# EAGLE design ESP32-S3 Parallel TFT with Touch 4.3“ V2.0 (EAGLE 6.1)
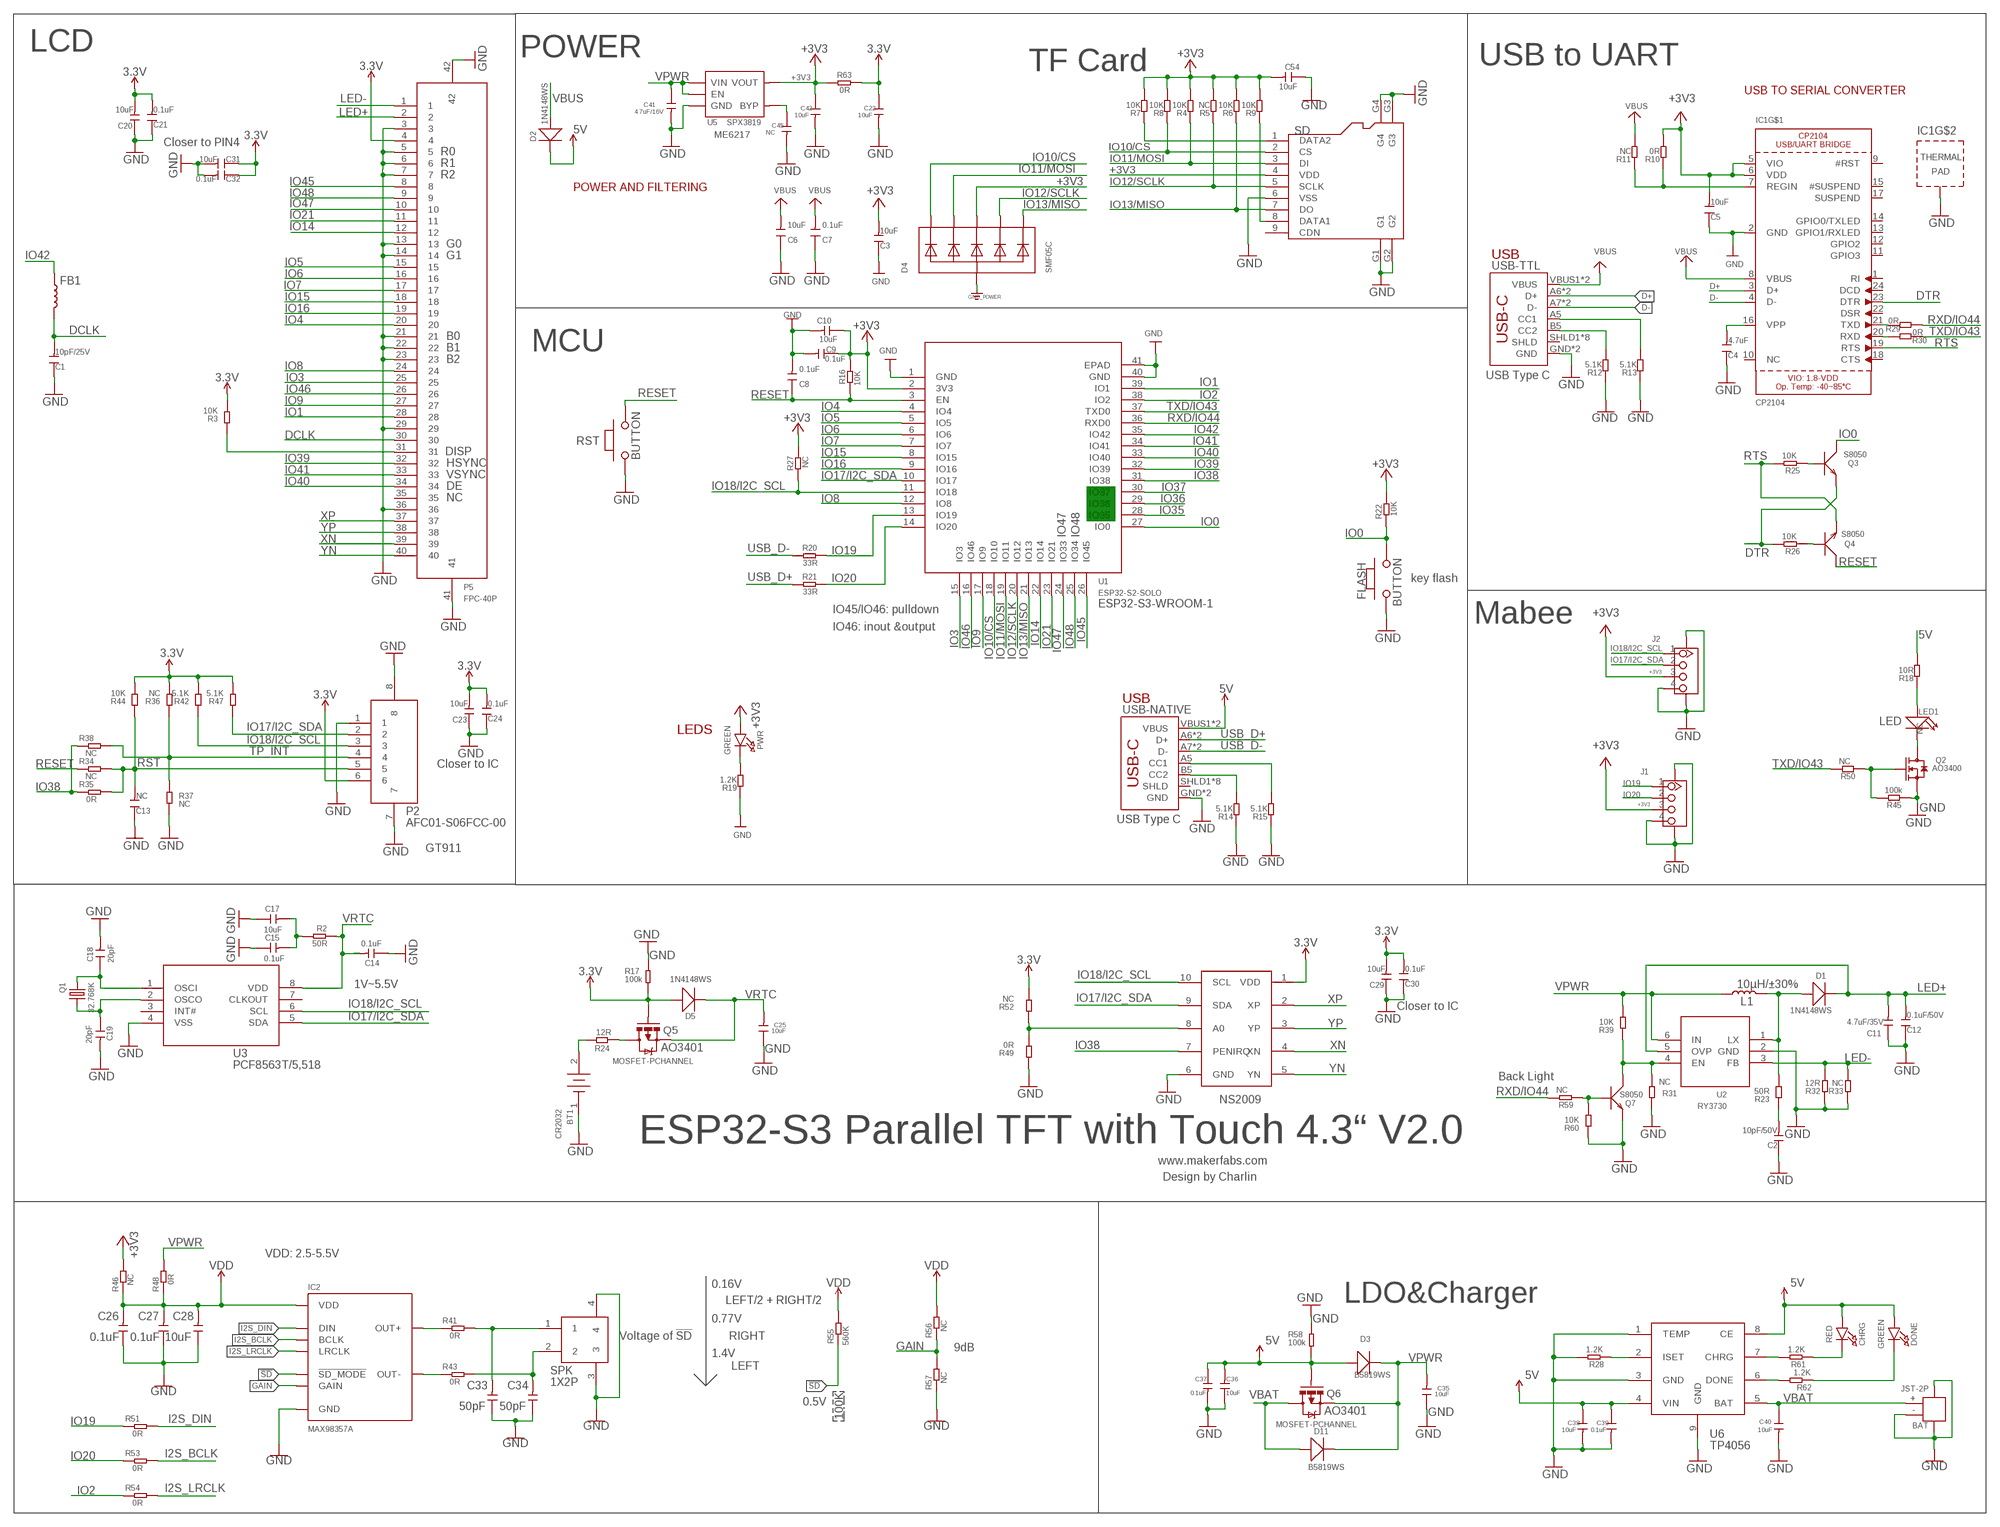
[diagram p0: schematic, sheet 1]

## Parts
BAT  JST-2P  JST-2P-SMD'2.0'  [HW2-SMD-2.0-90D]
BT1  CR2032  [CR2032]
C1  10pF/25V  DISCRETE_C-0603  [DISCRETE_C0603]
C2  10pF/50V  DISCRETE_C-0603  [DISCRETE_C0603]
C3  10uF  DISCRETE_C-0603  [DISCRETE_C0603]
C4  4.7uF  DISCRETE_C-0603  [DISCRETE_C0603]
C5  10uF  DISCRETE_C-0603  [DISCRETE_C0603]
C6  10uF  DISCRETE_C-0603  [DISCRETE_C0603]
C7  0.1uF  DISCRETE_C-0603  [DISCRETE_C0603]
C8  0.1uF  DISCRETE_C-0603  [DISCRETE_C0603]
C9  0.1uF  DISCRETE_C-0603  [DISCRETE_C0603]
C10  10uF  DISCRETE_C-0603  [DISCRETE_C0603]
C11  4.7uF/35V  DISCRETE_C-1206  [DISCRETE_C1206]
C12  0.1uF/50V  DISCRETE_C-0603  [DISCRETE_C0603]
C13  NC  DISCRETE_C-0603  [DISCRETE_C0603]
C14  0.1uF  DISCRETE_C-0603  [DISCRETE_C0603]
C15  0.1uF  DISCRETE_C-0603  [DISCRETE_C0603]
C17  10uF  DISCRETE_C-0603  [DISCRETE_C0603]
C18  20pF  DISCRETE_C-0603  [DISCRETE_C0603]
C19  20pF  DISCRETE_C-0603  [DISCRETE_C0603]
C20  10uF  DISCRETE_C-0603  [DISCRETE_C0603]
C21  0.1uF  DISCRETE_C-0603  [DISCRETE_C0603]
C22  10uF  C-0603  [0603]
C23  10uF  DISCRETE_C-0603  [DISCRETE_C0603]
C24  0.1uF  DISCRETE_C-0603  [DISCRETE_C0603]
C25  10uF  C-0603  [0603]
C26  0.1uF  C-0603  [0603]
C27  0.1uF  C-0603  [0603]
C28  10uF  C-0603  [0603]
C29  10uF  DISCRETE_C-0603  [DISCRETE_C0603]
C30  0.1uF  DISCRETE_C-0603  [DISCRETE_C0603]
C31  10uF  DISCRETE_C-0603  [DISCRETE_C0603]
C32  0.1uF  DISCRETE_C-0603  [DISCRETE_C0603]
C33  50pF  C-0603  [0603]
C34  50pF  C-0603  [0603]
C35  10uF  C-0603  [0603]
C36  10uF  C-0603  [0603]
C37  0.1uF  C-0603  [0603]
C38  10uF  C-0603  [0603]
C39  0.1uF  C-0603  [0603]
C40  10uF  C-0603  [0603]
C41  4.7uF/16V  C-0603  [0603]
C42  10uF  C-0603  [0603]
C45  NC  C-0603  [0603]
C54  10uF  DISCRETE_C-0603  [DISCRETE_C0603]
CHRG  RED  LED0805_NOOUTLINE  [CHIPLED_0805_NOOUTLINE]
D1  1N4148WS  D'0805'  [SOD323]
D2  1N4148WS  D'0805'  [SOD323]
D3  B5819WS  D'0805'  [SOD323]
D4  SMF05C  TVSARRAY_5LANE  [SOT363]
D5  1N4148WS  D'0805'  [SOD323]
D11  B5819WS  D'0805'  [SOD323]
DONE  GREEN  LED0805_NOOUTLINE  [CHIPLED_0805_NOOUTLINE]
FB1  INDUCTORFB-30OHM  [0603]
FLASH  BUTTON  PB157  [157SW]
IC1  CP2104  [QFN24_4MM_SMSC]
IC2  MAX98357A  [TQFN-16]
J1  GROVE-CONNECTOR-SMD'90D'  [HW4-SMD-2.0-90D]
J2  GROVE-CONNECTOR-SMD'90D'  [HW4-SMD-2.0-90D]
L1  10µH/±30%  INDUCTOR-CR54-3.3UH  [CR54]
LED1  NC  DISCRETE_LED3528  [DISCRETE_LED-3528]
P2  AFC01-S06FCC-00  [SMD8-50P-740L535W]
P5  FPC-40P  [SMD42-50P-2560L490W]
PWR  GREEN  LED0805_NOOUTLINE  [CHIPLED_0805_NOOUTLINE]
Q1  32.768K  CRYSTAL_3215  [XTAL3215]
Q2  AO3400  MOSFET-N'SOT23'  [SOT23@1]
Q3  S8050  TRANSISTOR-NPN-SOT23  [SOT23]
Q4  S8050  TRANSISTOR-NPN-SOT23  [SOT23]
Q5  MOSFET-PCHANNEL  [SOT23-3]
Q6  MOSFET-PCHANNEL  [SOT23-3]
Q7  S8050  TRANSISTOR-NPN-SOT23  [SOT23]
R2  50R  R-0603  [R0603]
R3  10K  DISCRETE_R-0603  [DISCRETE_R0603]
R4  10K  DISCRETE_R-0603  [DISCRETE_R0603]
R5  NC  DISCRETE_R-0603  [DISCRETE_R0603]
R6  10K  DISCRETE_R-0603  [DISCRETE_R0603]
R7  10K  DISCRETE_R-0603  [DISCRETE_R0603]
R8  10K  DISCRETE_R-0603  [DISCRETE_R0603]
R9  10K  DISCRETE_R-0603  [DISCRETE_R0603]
R10  0R  DISCRETE_R-0603  [DISCRETE_R0603]
R11  NC  DISCRETE_R-0603  [DISCRETE_R0603]
R12  5.1K  DISCRETE_R-0603  [DISCRETE_R0603]
R13  5.1K  DISCRETE_R-0603  [DISCRETE_R0603]
R14  5.1K  DISCRETE_R-0603  [DISCRETE_R0603]
R15  5.1K  DISCRETE_R-0603  [DISCRETE_R0603]
R16  10K  R-0603  [R0603]
R17  100k  R-0603  [R0603]
R18  10R  DISCRETE_R-0603  [DISCRETE_R0603]
R19  1.2K  DISCRETE_R-0603  [DISCRETE_R0603]
R20  33R  R-0603  [R0603]
R21  33R  R-0603  [R0603]
R22  10K  R-0603  [R0603]
R23  50R  DISCRETE_R-0603  [DISCRETE_R0603]
R24  12R  R-0603  [R0603]
R25  10K  R-0603  [R0603]
R26  10K  R-0603  [R0603]
R27  NC  R-0603  [R0603]
R28  1.2K  R-0603  [R0603]
R29  0R  R-0603  [R0603]
R30  0R  R-0603  [R0603]
R31  NC  DISCRETE_R-0603  [DISCRETE_R0603]
R32  12R  DISCRETE_R-0603  [DISCRETE_R0603]
R33  NC  DISCRETE_R-0603  [DISCRETE_R0603]
R34  NC  R-0603  [R0603]
R35  0R  R-0603  [R0603]
R36  NC  DISCRETE_R-0603  [DISCRETE_R0603]
R37  NC  DISCRETE_R-0603  [DISCRETE_R0603]
R38  NC  R-0603  [R0603]
R39  10K  DISCRETE_R-0603  [DISCRETE_R0603]
R41  0R  R-0603  [R0603]
R42  5.1K  DISCRETE_R-0603  [DISCRETE_R0603]
R43  0R  R-0603  [R0603]
R44  10K  DISCRETE_R-0603  [DISCRETE_R0603]
R45  100k  R-0603  [R0603]
R46  NC  R-0603  [R0603]
R47  5.1K  DISCRETE_R-0603  [DISCRETE_R0603]
R48  0R  R-0603  [R0603]
R49  0R  DISCRETE_R-0603  [DISCRETE_R0603]
R50  NC  R-0603  [R0603]
R51  0R  R-0603  [R0603]
R52  NC  DISCRETE_R-0603  [DISCRETE_R0603]
R53  0R  R-0603  [R0603]
R54  0R  R-0603  [R0603]
R55  560K  R-0603  [R0603]
R56  NC  R-0603  [R0603]
R57  NC  R-0603  [R0603]
R58  100k  R-0603  [R0603]
R59  NC  DISCRETE_R-0603  [DISCRETE_R0603]
R60  10K  DISCRETE_R-0603  [DISCRETE_R0603]
R61  1.2K  R-0603  [R0603]
R62  1.2K  R-0603  [R0603]
R63  0R  R-0603  [R0603]
RST  BUTTON  PB157  [157SW]
SD  HOLDER-MICROSD-9P  [9P-SMD-W/-RING]
SPK  1X2P  [1X2P-SMT1.25MM]
U1  ESP32­S2­SOLO  [ESP32-­S2-­SOLO]
U2  RY3730  [SOT23-6]
U3  PCF8563T/5,518  [SOP8]
U5  SPX3819  [SOT23-5]
U6  TP4056  [SOP8-1.27P]
U8  NS2009  [MSOP10]
USB-NATIVE  USB_C5  [USB-C-16P-5]
USB-TTL  USB_C5  [USB-C-16P-5]

## Nets
3.3V: C20.2 C21.2 C22.1 C23.2 C24.2 C29.2 C30.2 C31.1 C32.1 D5.+ P2.6 P5.4 Q5.1(G) R3.2 R17.1 R36.2 R42.2 R44.2 R47.2 R52.2 R63.2 U8.1(VDD)
5V: C36.2 C37.1 C38.1 C39.1 CHRG.A D2.- D3.+ DONE.A Q6.1(G) R18.2 R58.1 U6.4(VIN) U6.8(CE) USB-NATIVE.VBUS1(VBUS) USB-NATIVE.VBUS2(VBUS)
!SD: IC2.P$4(!SD_MODE) R55.1
+3V3: C3.2 C5.2 C9.1 C10.1 C42.1 C54.2 D4.4(C3) IC1.5(VIO) IC1.6(VDD) J1.3 J2.3 PWR.A R4.2 R5.2 R6.2 R7.2 R8.2 R9.2 R10.2 R16.2 R22.2 R27.2 R46.2 R63.1 SD.4(VDD) U1.2(3V3) U5.5(VOUT)
D+: IC1.3(D+) USB-TTL.A6(D+) USB-TTL.B6(D+)
D-: IC1.4(D-) USB-TTL.A7(D-) USB-TTL.B7(D-)
DCLK: C1.2 FB1.2 P5.30
DTR: IC1.23(DTR) Q3.2(E) R26.2
GAIN: IC2.P$2(GAIN) R56.1 R57.2
GND: BAT.3 BAT.4 BAT.- BT1.1 C1.1 C2.1 C3.1 C4.1 C5.1 C6.1 C7.1 C8.2 C9.2 C10.2 C11.1 C12.1 C13.1 C14.1 C15.1 C17.1 C18.2 C19.2 C20.1 C21.1 C22.2 C23.1 C24.1 C25.1 C26.1 C27.1 C28.1 C29.1 C30.1 C31.2 C32.2 C33.1 C34.1 C35.1 C36.1 C37.2 C38.2 C39.2 C40.2 C41.2 C42.2 C45.2 C54.1 D4.2(A) FLASH.1 IC1.2(GND) IC1.THERM(TP) IC2.P$3(GND) IC2.P$11(GND) IC2.P$15(GND) IC2.P$EP(GND) J1.4 J1.SS1 J1.SS2 J2.4 J2.SS1 J2.SS2 P2.1 P2.7 P2.8 P5.3 P5.5 P5.6 P5.7 P5.13 P5.14 P5.21 P5.22 P5.23 P5.29 P5.36 P5.41 P5.42 Q2.2(S) Q7.2(E) R12.1 R13.1 R14.1 R15.1 R17.2 R19.1 R28.2 R31.1 R32.1 R33.1 R37.2 R45.1 R49.1 R57.1 R58.2 R60.1 RST.1 SD.6(VSS) SD.G1 SD.G2 SD.G3 SD.G4 SPK.3 SPK.4 U1.1(GND) U1.40(GND) U1.41(EPAD) U2.2(GND) U3.4(VSS) U5.2(GND) U6.1(TEMP) U6.3(GND) U6.9(GND) U8.6(GND) USB-NATIVE.GND USB-NATIVE.GND2(GND) USB-TTL.GND USB-TTL.GND2(GND) ; supply symbol labelled GND_POWER
I2S_BCLK: IC2.P$16(BCLK) R53.2
I2S_DIN: IC2.P$1(DIN) R51.2
I2S_LRCLK: IC2.P$14(LRCLK) R54.2
IO0: FLASH.2 Q3.3(C) R22.1 U1.27(IO0)
IO1: P5.28 U1.39(IO1)
IO2: R54.1 U1.38(IO2)
IO3: P5.25 U1.15(IO3)
IO4: P5.20 U1.4(IO4)
IO5: P5.15 U1.5(IO5)
IO6: P5.16 U1.6(IO6)
IO7: P5.17 U1.7(IO7)
IO8: P5.24 U1.12(IO8)
IO9: P5.27 U1.17(IO9)
IO10/CS: D4.1(C1) R8.1 SD.2(CS) U1.18(IO10)
IO11/MOSI: D4.3(C2) R4.1 SD.3(DI) U1.19(IO11)
IO12/SCLK: D4.5(C4) R5.1 SD.5(SCLK) U1.20(IO12)
IO13/MISO: D4.6(C5) R6.1 SD.7(DO) U1.21(IO13)
IO14: P5.12 U1.22(IO14)
IO15: P5.18 U1.8(IO15)
IO16: P5.19 U1.9(IO16)
IO17/I2C_SDA: J2.2 P2.2 R47.1 U1.10(IO17) U3.5(SDA) U8.9(SDA)
IO18/I2C_SCL: J2.1 P2.3 R27.1 R42.1 U1.11(IO18) U3.6(SCL) U8.10(SCL)
IO19: J1.1 R20.2 R51.1 U1.13(IO19)
IO20: J1.2 R21.2 R53.1 U1.14(IO20)
IO21: P5.11 U1.23(IO21)
IO35: U1.28(IO35)
IO36: U1.29(IO36)
IO37: U1.30(IO37)
IO38: R35.1 R38.1 U1.31(IO38) U8.7(PENIRQ)
IO39: P5.32 U1.32(IO39)
IO40: P5.34 U1.33(IO40)
IO41: P5.33 U1.34(IO41)
IO42: FB1.1 U1.35(IO42)
IO45: P5.8 U1.26(IO45)
IO46: P5.26 U1.16(IO46)
IO47: P5.10 U1.24(IO33)
IO48: P5.9 U1.25(IO34)
LED+: C11.2 C12.2 D1.- P5.2 U2.5(OVP)
LED-: P5.1 R32.2 R33.2 U2.3(FB)
N$1: C4.2 IC1.16(VPP)
N$2: Q4.1(B) R26.1
N$3: Q3.1(B) R25.1
N$4: C18.1 Q1.P$1 U3.1(OSCI)
N$5: Q2.1(G) R45.2 R50.1
N$6: R15.2 USB-NATIVE.A5(CC1)
N$7: PWR.C R19.2
N$8: LED1.1(+) R18.1
N$9: LED1.2(-) Q2.3(D)
N$10: R13.2 USB-TTL.A5(CC1)
N$11: R12.2 USB-TTL.B5(CC2)
N$12: IC1.7(REGIN) R10.1 R11.1
N$13: C19.1 Q1.P$2 U3.2(OSCO)
N$14: R14.2 USB-NATIVE.B5(CC2)
N$15: Q5.3(D) R24.1
N$16: C15.2 C17.2 R2.1
N$17: D1.+ L1.P$2 R23.2 U2.1(LX)
N$18: IC1.21(TXD) R29.2
N$19: IC1.20(RXD) R30.2
N$20: BT1.2 R24.2
N$21: IC2.P$9(OUT+) R41.1
N$22: C2.2 R23.1
N$23: IC2.P$10(OUT-) R43.1
N$24: Q7.3(C) R31.2 R39.1 U2.4(EN)
N$25: R49.2 R52.1 U8.8(A0)
N$26: C33.2 R41.2 SPK.1
N$27: C34.2 R43.2 SPK.2
N$28: P5.31 R3.1
N$29: Q7.1(B) R59.1 R60.2
N$30: R28.1 U6.2(ISET)
N$31: R61.2 U6.7(CHRG)
N$32: R62.2 U6.6(DONE)
N$33: CHRG.C R61.1
N$34: DONE.C R62.1
N$47: R7.1 SD.1(DATA2)
N$48: R9.1 SD.8(DATA1)
N$76: C45.1 U5.4(BYP)
RESET: C8.1 Q4.3(C) R16.1 R34.1 RST.2 U1.3(EN)
RST: C13.2 P2.5 R34.2 R35.2 R44.1
RTS: IC1.19(RTS) Q4.2(E) R25.2
RXD/IO44: R29.1 R59.2 U1.36(RXD0)
TP_INT: P2.4 R36.1 R37.1 R38.2
TXD/IO43: R30.1 R50.2 U1.37(TXD0)
USB_D+: R21.1 USB-NATIVE.A6(D+) USB-NATIVE.B6(D+)
USB_D-: R20.1 USB-NATIVE.A7(D-) USB-NATIVE.B7(D-)
VBAT: BAT.+ C40.1 D11.+ Q6.3(D) U6.5(BAT)
VBUS: C6.2 C7.2 D2.+ IC1.8(VBUS) R11.2 USB-TTL.VBUS1(VBUS) USB-TTL.VBUS2(VBUS)
VDD: C26.2 C27.2 C28.2 IC2.P$7(VDD) IC2.P$8(VDD) R46.1 R48.1 R55.2 R56.2
VPWR: C35.2 C41.1 D3.- D11.- L1.P$1 Q6.2(S) R39.2 R48.2 U2.6(IN) U5.1(VIN) U5.3(EN)
VRTC: C14.2 C25.2 D5.- Q5.2(S) R2.2 U3.8(VDD)
XN: P5.39 U8.4(XN)
XP: P5.37 U8.2(XP)
YN: P5.40 U8.5(YN)
YP: P5.38 U8.3(YP)
Unconnected: IC1.1(RI) IC1.9(#RST) IC1.10(NC) IC1.11(GPIO3) IC1.12(GPIO2) IC1.13(GPIO1/RXLED) IC1.14(GPIO0/TXLED) IC1.15(#SUSPEND) IC1.17(SUSPEND) IC1.18(CTS) IC1.22(DSR) IC1.24(DCD) P5.35 SD.9(CDN) U3.3(INT#) U3.7(CLKOUT) USB-NATIVE.SHLD1(SHLD) USB-NATIVE.SHLD2(SHLD) USB-NATIVE.SHLD3(SHLD) USB-NATIVE.SHLD4(SHLD) USB-NATIVE.SHLD5(SHLD) USB-NATIVE.SHLD6(SHLD) USB-NATIVE.SHLD7(SHLD) USB-NATIVE.SHLD8(SHLD) USB-TTL.SHLD1(SHLD) USB-TTL.SHLD2(SHLD) USB-TTL.SHLD3(SHLD) USB-TTL.SHLD4(SHLD) USB-TTL.SHLD5(SHLD) USB-TTL.SHLD6(SHLD) USB-TTL.SHLD7(SHLD) USB-TTL.SHLD8(SHLD)

## Notes on the sheet
- LCD | POWER
- TF Card | USB to UART
- USB TO SERIAL CONVERTER
- ME6217
- Closer to PIN4
- R0
- R1
- R2
- POWER AND FILTERING
- G0
- G1 | USB
- B0
- B1 | MCU
- B2
- USB Type C
- DISP
- HSYNC
- VSYNC
- DE
- NC
- IO47 | IO48
- key flash
- ESP32-S3-WROOM-1
- IO45/IO46: pulldown
- Mabee
- IO46: inout &output
- USB
- LED
- LEDS
- Closer to IC
- USB Type C
- GT911
- 1V~5.5V
- Closer to IC
- AO3401
- Back Light
- NS2009
- ESP32-S3 Parallel TFT with Touch 4.3“ V2.0
- www.makerfabs.com
- Design by Charlin
- VDD: 2.5-5.5V
- 0.16V
- LEFT/2 + RIGHT/2 | LDO&Charger
- 0.77V
- Voltage of !SD | RIGHT
- 9dB
- 1.4V
- LEFT
- 0.5V
- AO3401
- 100K

## Library data of the parts
BAT = Connector-new:JST-2P-SMD: 2P-SMD-1.0-90D:320110054;2P-SMD-2.0-90D:320110026
BT1 = sale:CR2032
C1-C15 C17-C21 C23 C24 C29-C32 C54 = A9G:DISCRETE_C*: Ceramic Capacitors
C22 C25-C28 C33-C42 C45 = Discrete:C*: Ceramic Capacitors
CHRG DONE PWR = microbuilder:LED: LED 0603 - 0603 Surface Mount Package 2mA: Green LED - Low Power (3.9mcd, 2ma, 1.7Vf) - Digikey: 475-2709-2-ND Orange LED - Low Power (9.8mcd, 2ma, 1.8Vf) - Digikey: 475-1194-2-ND Red LED - Low Power (5mcd, 2ma, 1.8Vf) - Digikey: 475-1195-2-ND Yellow LED - Low Power (7mcd, 2ma, 1.8Vf) - Digikey: 475-1196-2-ND 5mA: Blue LED - Low Power (17mcd, 5ma, 2.9Vf) - Digikey: LNJ937W8CRACT-ND 0805 - 0805 Surface Mount Package 2mA: Red LED (8.8mcd, 2mA, 1.8Vf, Clear) - Low Power [Digikey: 475-2510-1-ND] Green LED (5mcd, 2mA, 1.8Vf, Clear) - Low Power [Digikey: 475-2730-1-ND] Yellow LED (11.3mcd, 2mA, 1.8Vf, Clear) - Low Power [Digikey: 475-2555-1-ND] 20mA: Red LED (104mcd, 20mA, Diffused) - LS R976 [Digikey: 475-1278-6-ND] Red LED (12mcd, 20mA, 2.0Vf, Clear) - APT2012EC [Digikey: 754-1128-1-ND] Green LED (15mcd, 20mA, 2.2Vf, Clear) - APT2012GC [Digikey: 754-1131-1-ND] Orange LED (160mcd, 20mA, 2.1Vf, Clear) - APT2012SECK [Digikey: 754-1130-1-ND] 1206 - 1206 Surface Mount Package Green LED (26mcd, 20mA, Diffused) - LG N971 [Digikey: 475-1407-6-ND] Red LED (15mcd, 20mA, Diffused) - LH N974 [Digikey: 475-1416-6-ND] Cree - Cree High-Power Surface Mount LEDs XPEBWT-L1-0000-00D50 - White 111lm 350mA 2.9Vf 6200K 110° XTEAWT-00-0000-00000LEE3 - White 114lm 350mA 2.85Vf 5000K 115° Everlight - Everlight 45-21 Series Surface Mount LEDs 45-21/QK2C-B2832AC2CB2/2T - Warm White 2000mcd 20mA 3.25Vf 3050K 120° 45-21/LK2C-B38452C4CB2/2T - Nuetral White 2000mcd 20mA 3.25Vf 4150K 120° 45-21/LK2C-B50634C6CB2/2T - Cold White 2200mcd 20mA 3.25Vf 5650K 120° PLCC2 Reverse Mount LS T77K-J1L2-1-0-2-R18-Z - Red 11.25mcd 2mA 1.8Vf 630nm 120° LO T77K-L1M2-24-Z - Orange 19.6mcd 2mA 1.8Vf 606nm 120° LY T77K-K2M1-26-Z - Yellow 15.7mcd 2mA 1.8Vf 587nm 120°
D1-D3 D5 D11 = Discrete:D*
D4 = microbuilder:TVSARRAY_5LANE: Voltage Transient Suppressor Array SOT363 SMF05C - 100W 5V: Digikey - SMF05CT1GOSCT-ND
FB1 = SparkFun-Coils:INDUCTOR: Inductors Resist changes in electrical current. Basically a coil of wire. SparkFun Products: SparkFun Load Cell Amplifier - HX711 <https://www.sparkfun.com/products/13879> IOIO-OTG - V2.2 <https://www.sparkfun.com/products/13613>; PROD_ID: NDUC-07859
FLASH RST = MySMD:PB157
IC1 = microbuilder:CP2104: CP2104 - USB to UART Bridge VDD Output: 3.45V
IC2 = SparkFun-IC-Amplifiers:MAX98357A: I2S DAC 3.2W (4-8ohm); PROD_ID: IC-14032
J1 J2 = Connector-new:GROVE-CONNECTOR-SMD: 4P-SMD-2.0:320110030;4P-SMD-2.0-90D:320110032
L1 = SparkFun-Coils:INDUCTOR: Inductors Resist changes in electrical current. Basically a coil of wire. SparkFun Products: SparkFun Load Cell Amplifier - HX711 <https://www.sparkfun.com/products/13879> IOIO-OTG - V2.2 <https://www.sparkfun.com/products/13613>; PROD_ID: NDUC-11157; VALUE: 3.3µH/±30%/3.4A
LED1 = Relay:DISCRETE_LED*
P2 = self:AFC01-S06FCC-00
P5 = self:FPC-40P
Q1 = microbuilder:CRYSTAL: Crystals HC49UP - Surface Mount Crystal 4.0MHz 18pF +/-30ppm Surface Mount Crystal [Digikey: 535-9857-1-ND] 12.0 MHz Surface Mount Crystal [Digikey: 535-9869-6-ND] 25.0 MHz Surface Mount Crystal [Digikey: 535-9078-1-ND] 2.5 x 2.0mm - MEMs SMT Crystal 16.0 MHz 10pF 20ppm 2.5 x 2.0mm Crystal [Digikey -40-85°C: 535-10923-1-ND] 3.2 x 2.5mm - MEMs SMT Crystal 12.0 MHz 8pF 15ppm 3.2 x 2.5mm Crystal [Digikey: -10-70°C: 644-1047-1-ND -40-125°C: 644-1128-1-ND] 40~85°C cheaper: 644-1173-6-ND 16.0 MHz 8pF 15ppm 3.2 x 2.5mm Crystal [Digikey: -10-70°C: 644-1049-1-ND -40-125°C: 644-1129-2-ND]-40~85°C cheaper: 644-1175-6-ND 16.0 MHz 10pF 10ppm 3.2 x 2.5mm Crystal [Digikey: 644-1100-1-ND] 27.12 MHz 18pF 30ppm 3.2 x 2.5mm Crystal [Digikey: 887-1424-1-ND] 27.12MHz 10pF 10ppm 3.2 x 2.5mm Crystal [Digikey: 887-1329-1-ND] 4.9 x 1.8mm - MEMs SMT Crystal 32.768 KHz 12.5pF 20ppm 4.9 x 1.8mm Crystal [Digikey: SE2415CT-ND] 8.0 x 3.8mm - Surface Mount Crystal 32.768kHz 12.5pF 20ppm -40°C-85°C [Digikey: 535-9166-2-ND] Cylinder 32.768KHz Cylinder Crystal (2x6mm body) [Ex. Digikey: 300-8341-2-ND]
Q2 = Discrete:MOSFET-N: IRLL014: http://www.vishay.com/docs/91319/sihll014.pdf
Q3 Q4 Q7 = Discrete:TRANSISTOR-NPN*: NPN audion
Q5 Q6 = User-Submitted:MOSFET-PCHANNEL: Generic PMOSFET IRLML2244 - TRANS-11153 (SOT-23 -20V -4.3A) (1.Gate 2.Source 3.Drain) FQP27P06 - COM-10349 <http://www.sparkfun.com/products/10349> (TO-220 -60V -27A) (1.Gate 2.Source 3.Drain); PROD_ID: TRANS-08285
R2 R16 R17 R20-R22 R24-R30 R34 R35 R38 R41 R43 R45 R46 R48 R50 R51 R53-R58 R61-R63 = Discrete:R*
R3-R15 R18 R19 R23 R31-R33 R36 R37 R39 R42 R44 R47 R49 R52 R59 R60 = A9G:DISCRETE_R*
SD = Connector:HOLDER-MICROSD-9P
SPK = sale:1X2P
U1 = self:ESP32­S2­SOLO
U2 = sale:RY3730
U3 = sale:PCF8563T/5,518
U5 = IC:SPX3819
U6 = self:TP4056
U8 = NS2009:NS2009
USB-NATIVE USB-TTL = USBC:USB_C: USB Type C 16Pin Connector Super Speed pins not available on the 16-pin purely SMD connector so this part is best for USB 2.0 implementations. D1 and D2 are tied together enabling D+/- no matter which way the cable is plugged into the connector. The two channel configuration pins (CC1/2) are exposed. These are normally connected to ground via 5.1k resistors but can be reconfigured for high current/high power applications.

## Net classes
0 default: width 0.152 mm, drill 0.305 mm, clearance 0.152 mm
1 vbat: width 0.254 mm, drill 0.305 mm, clearance 0.152 mm

## Board
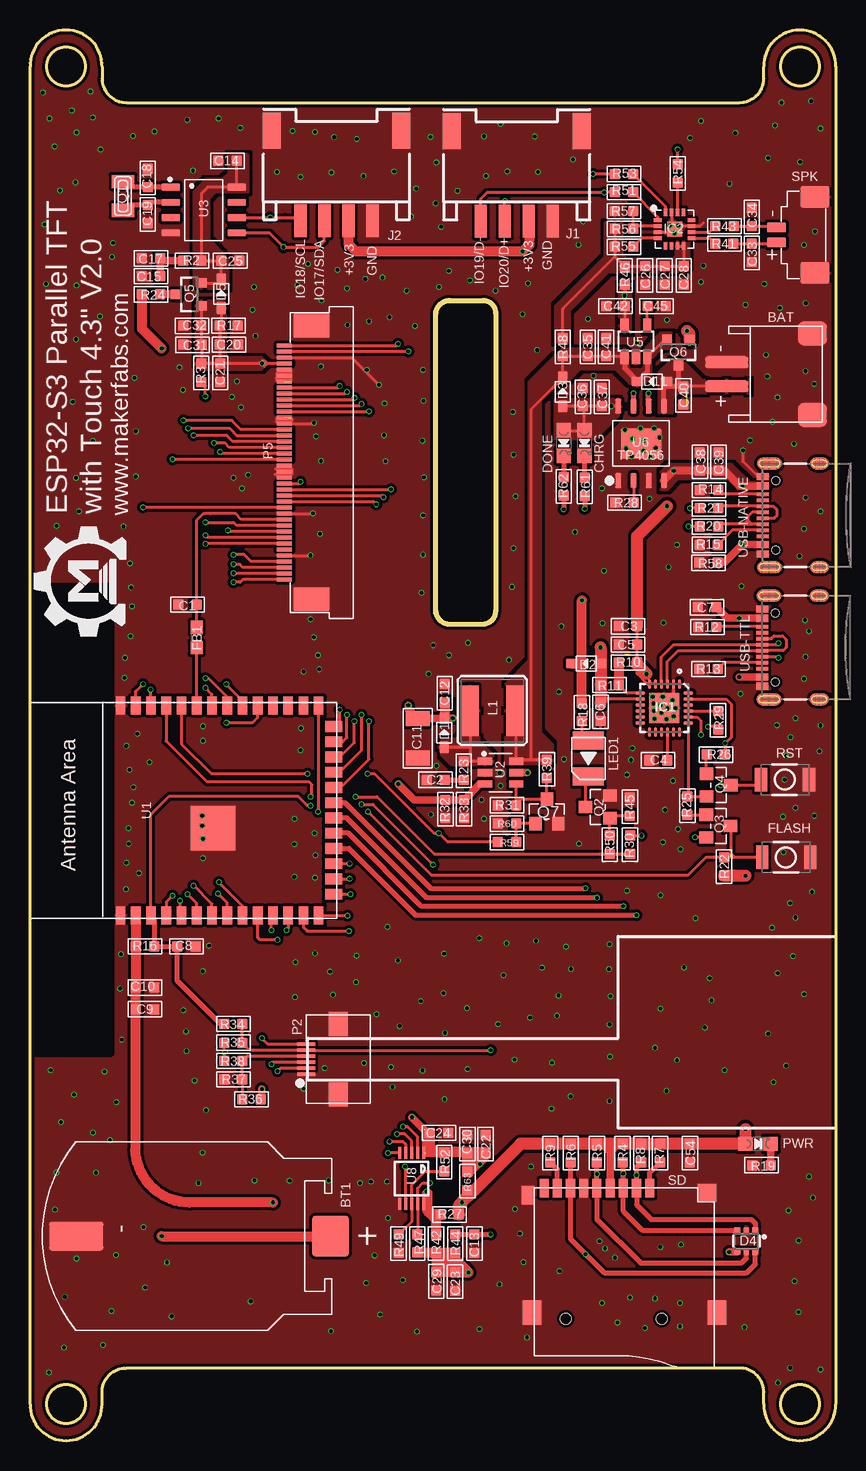
[diagram p1: board, top side]
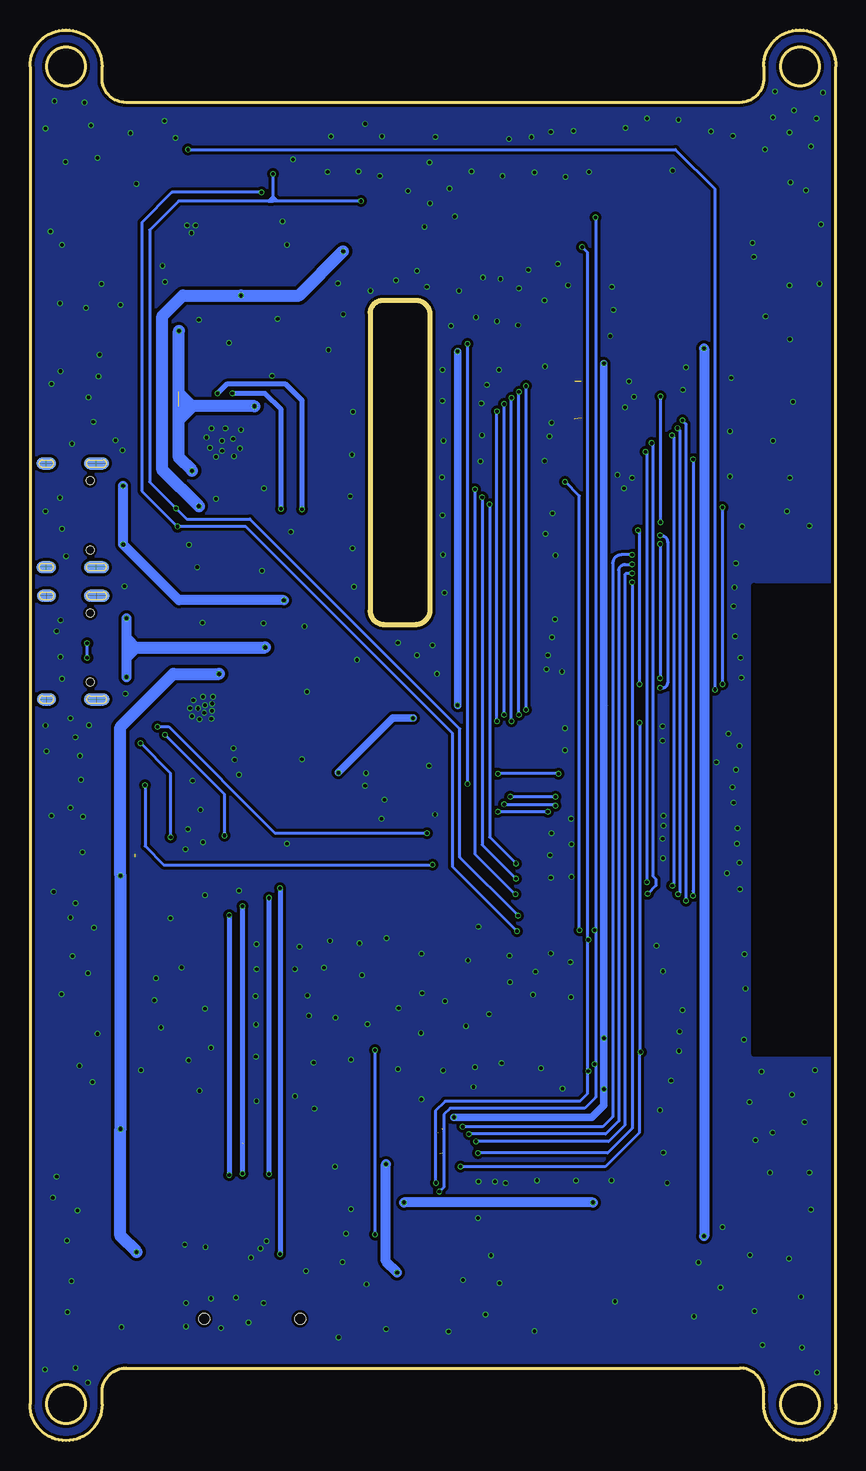
[diagram p2: board, bottom side, seen from below]

Size 67.15 x 117.6 mm. Coordinates in mm from the lower left corner, seen from the top.
Outline: 61.15,3.05 61.15,4.05 arc90 59.15,6.05 8,6.05 arc90 6,4.05 6,3.05 arc-182 0,3.05 0,114.55 arc-182 6,114.55 6,113.55 arc90 8,111.55 59.15,111.55 arc90 61.15,113.55 61.15,114.55 arc-182 67.15,114.55 67.15,3.05 arc-182 61.15,3.05
Outline: 38.81,94.01 38.81,69.18 arc-90 37.67,68.05 35,68.05 arc-90 33.81,69.24 33.81,93.87 arc-90 34.98,95.05 37.77,95.05 arc-90 38.81,94.01
Outline: circle at 3,114.55 radius 1.6
Outline: circle at 3,3.05 radius 1.6
Outline: circle at 64.15,3.05 radius 1.6
Outline: circle at 64.15,114.55 radius 1.6
Copper layers (1*16): Top 0.035mm / dielectric 1.5mm / Bottom 0.035mm
Design rules: minimum track width 6mil, minimum drill 10mil, track to track 6mil, track to pad 6mil, pad to pad 6mil, via to via 6mil, smd to smd 0mil, copper to edge 10mil, drill to drill 10mil, minimum pad ring 3mil, minimum via ring 3mil, stop-mask expansion 2mil, vias tented up to drill 100mil, thermal gap 0mil
tRestrict: area 0,32.2 to 6.8,71.2
bRestrict: area 0,32.2 to 6.8,71.2

### Footprints (pad centres in the part's own frame; a part is rotated, then mirrored left to right if it is on the bottom)
HW2-SMD-2.0-90D = smd 2 x 2.4: 3 3.4,-2.181; 4 -3.4,-2.181 | smd 1 x 3.6: + -1,4.953; - 1,4.953
CR2032 = smd 4.5 x 2.4: 1 -10.95,0 | smd 3.05 x 3.4: 2 10.225,0
DISCRETE_C0603 = smd 0.889 x 0.889: 1 -0.762,0; 2 0.762,0
DISCRETE_C1206 = smd 1.27 x 2.032: 1 -1.651,0; 2 1.651,0
0603 = smd 0.889 x 0.889: 1 -0.762,0; 2 0.762,0
CHIPLED_0805_NOOUTLINE = smd 1.2 x 1.2: A 0,-1.05; C 0,1.05
SOD323 = smd 1 x 0.8: + -1.2,0; - 1.2,0
SOT363 = smd 0.5 x 0.5: 1 -0.75,-0.9; 3 0.75,-0.9; 4 0.75,0.9; 6 -0.75,0.9 | smd 0.4 x 0.5: 2 0,-0.9; 5 0,0.9
0603' = smd 1.1 x 1: 1 -0.85,0; 2 0.85,0
157SW = smd 1.016 x 1.981: 1 0,0; 2 4,0
QFN24_4MM_SMSC = smd 0.8 x 0.28: 1 -2,1.25; 2 -2,0.75; 3 -2,0.25; 4 -2,-0.25; 5 -2,-0.75; 6 -2,-1.25; 13 2,-1.25; 14 2,-0.75; 15 2,-0.25; 16 2,0.25; 17 2,0.75; 18 2,1.25 | smd 0.28 x 0.8: 7 -1.25,-2; 8 -0.75,-2; 9 -0.25,-2; 10 0.25,-2; 11 0.75,-2; 12 1.25,-2; 19 1.25,2; 20 0.75,2; 21 0.25,2; 22 -0.25,2; 23 -0.75,2; 24 -1.25,2 | smd 2.5 x 2.5: THERM 0,0
TQFN-16 = smd 0.3 x 0.65: P$1 -0.75,-1.4; P$2 -0.25,-1.4; P$3 0.25,-1.4; P$4 0.75,-1.4; P$9 0.75,1.4; P$10 0.25,1.4; P$11 -0.25,1.4; P$12 -0.75,1.4 | smd 0.65 x 0.3: P$5 1.4,-0.75; P$6 1.4,-0.25; P$7 1.4,0.25; P$8 1.4,0.75; P$13 -1.4,0.75; P$14 -1.4,0.25; P$15 -1.4,-0.25; P$16 -1.4,-0.75 | smd 1.23 x 1.23: P$EP 0,0
HW4-SMD-2.0-90D = smd 1.01 x 2.74: 1 -3,-0.1; 2 -1,-0.1; 3 1,-0.1; 4 3,-0.1 | smd 1.5 x 3: SS1 -5.4,7.4; SS2 5.4,7.4
CR54 = smd 4.2 x 1.4: P$1 0,1.85; P$2 0,-1.85
DISCRETE_LED-3528 = smd 1.5 x 2.6: 1 -1.5,0; 2 1.5,0
SMD8-50P-740L535W = smd 0.3 x 1.5: 1 -1.25,0; 2 -0.75,0; 3 -0.25,0; 4 0.25,0; 5 0.75,0; 6 1.25,0 | smd 2 x 1.6: 7 2.95,-2.68; 8 -2.95,-2.68
SMD42-50P-2560L490W = smd 0.3 x 1.3: 1 9.75,0; 2 9.25,0; 3 8.75,0; 4 8.25,0; 5 7.75,0; 6 7.25,0; 7 6.75,0; 8 6.25,0; 9 5.75,0; 10 5.25,0; 11 4.75,0; 12 4.25,0; 13 3.75,0; 14 3.25,0; 15 2.75,0; 16 2.25,0; 17 1.75,0; 18 1.25,0; 19 0.75,0; 20 0.25,0; 21 -0.25,0; 22 -0.75,0; 23 -1.25,0; 24 -1.75,0; 25 -2.25,0; 26 -2.75,0; 27 -3.25,0; 28 -3.75,0; 29 -4.25,0; 30 -4.75,0; 31 -5.25,0; 32 -5.75,0; 33 -6.25,0; 34 -6.75,0; 35 -7.25,0; 36 -7.75,0; 37 -8.25,0; 38 -8.75,0; 39 -9.25,0; 40 -9.75,0 | smd 2 x 3: 41 -11.4,-2.25; 42 11.4,-2.25
XTAL3215 = smd 1.1 x 1.9: P$1 1.2,0; P$2 -1.2,0
SOT23@1 = smd 1.016 x 1.143: 1 -0.95,-1.016; 2 0.95,-1.016; 3 0,1.016
SOT23 = smd 1.016 x 1.143: 1 -0.95,-1.016; 2 0.95,-1.016; 3 0,1.016
SOT23-3 = smd 0.8 x 0.9: 1 -0.95,-1; 2 0.95,-1; 3 0,1.1
R0603 = smd 0.889 x 0.889: 1 -0.762,0; 2 0.762,0
DISCRETE_R0603 = smd 0.889 x 0.889: 1 -0.762,0; 2 0.762,0
9P-SMD-W/-RING = smd 1.524 x 0.762: 1 0,4.4; 2 0,3.3; 3 0,2.2; 4 0,1.1; 5 0,0; 6 0,-1.1; 7 0,-2.2; 8 0,-3.3; 9 0,-4.4 | smd 1.524 x 1.016: G1 0.6,-5.746 | smd 2.032 x 1.524: G2 10.373,-5.4; G3 10.373,10 | smd 1.524 x 1.524: G4 0.392,9.181 | hole 0.889: 10.9,-2.6; 10.9,5.4
1X2P-SMT1.25MM = smd 0.8 x 1.6: 1 -0.625,0; 2 0.625,0 | smd 1.8 x 2.4: 3 3.175,-3.2; 4 -3.175,-3.2
ESP32-­S2-­SOLO = smd 1.5 x 0.9: 1 -8.75,5.26; 2 -8.75,3.99; 3 -8.75,2.72; 4 -8.75,1.45; 5 -8.75,0.18; 6 -8.75,-1.09; 7 -8.75,-2.36; 8 -8.75,-3.63; 9 -8.75,-4.9; 10 -8.75,-6.17; 11 -8.75,-7.44; 12 -8.75,-8.71; 13 -8.75,-9.98; 14 -8.75,-11.25; 27 8.75,-11.25; 28 8.75,-9.98; 29 8.75,-8.71; 30 8.75,-7.44; 31 8.75,-6.17; 32 8.75,-4.9; 33 8.75,-3.63; 34 8.75,-2.36; 35 8.75,-1.09; 36 8.75,0.18; 37 8.75,1.45; 38 8.75,2.72; 39 8.75,3.99; 40 8.75,5.26 | smd 0.9 x 1.5: 15 -6.985,-12.5; 16 -5.715,-12.5; 17 -4.445,-12.5; 18 -3.175,-12.5; 19 -1.905,-12.5; 20 -0.635,-12.5; 21 0.635,-12.5; 22 1.905,-12.5; 23 3.175,-12.5; 24 4.445,-12.5; 25 5.715,-12.5; 26 6.985,-12.5 | smd 3.7 x 3.7: 41 -1.5,-2.46
SOT23-6 = smd 1.2 x 0.6: 1 -1.3,0.95; 2 -1.3,0; 3 -1.3,-0.95; 4 1.3,-0.95; 5 1.3,0; 6 1.3,0.95
SOP8 = smd 1.52 x 0.6: 1 -2.74,1.905; 2 -2.74,0.635; 3 -2.74,-0.635; 4 -2.74,-1.905; 5 2.74,-1.905; 6 2.74,-0.635; 7 2.74,0.635; 8 2.74,1.905
SOT23-5 = smd 0.69 x 1.2: 1 -0.95,-1.3; 2 0,-1.3; 3 0.95,-1.3; 4 0.95,1.3; 5 -0.95,1.3
SOP8-1.27P = smd 1.27 x 0.51: 1 -3.1,1.905; 2 -3.1,0.635; 3 -3.1,-0.635; 4 -3.1,-1.905; 5 3.1,-1.905; 6 3.1,-0.635; 7 3.1,0.635; 8 3.1,1.905 | smd 2.5 x 3.4: 9 0,0
MSOP10 = smd 0.25 x 1: 1 -1,-2.113; 2 -0.5,-2.113; 3 0,-2.113; 4 0.5,-2.113; 5 1,-2.113; 6 1,2.113; 7 0.5,2.113; 8 0,2.113; 9 -0.5,2.113; 10 -1,2.113
USB-C-16P-5 = smd 0.3 x 1: A5 -1.25,-0.34; A6 -0.25,-0.34; A7 0.25,-0.34; A8 1.25,-0.34; B5 1.75,-0.34; B6 0.75,-0.34; B7 -0.75,-0.34; B8 -1.75,-0.34 | smd 0.6 x 1: GND -3.225,-0.34; GND2 3.225,-0.34; VBUS1 -2.45,-0.34; VBUS2 2.45,-0.34 | smd 1 x 2.1: SHLD1 -4.32,-0.915; SHLD2 4.32,-0.915 | smd 1 x 2.1 bottom: SHLD3 -4.32,-0.915; SHLD4 4.32,-0.915 | smd 1 x 1.6: SHLD5 -4.32,-5.095; SHLD8 4.32,-5.095 | smd 1 x 1.6 bottom: SHLD6 -4.32,-5.095; SHLD7 4.32,-5.095 | hole 0.65: -2.89,-1.445; 2.89,-1.445

### Placement (x,y rotation side)
BAT  63.02,88.9 90 top
BT1  14.81,17.05 0 top
C1  13.13,69.7 0 top
C2  33.81,55.1 0 top
C3  49.83,67.9 0 top
C4  52.35,56.72 0 top
C5  49.83,66.37 0 top
C6  47.55,60.76 90 top
C7  56.41,69.47 0 top
C8  13.03,41.2 0 top
C9  9.58,35.97 0 top
C10  9.58,37.77 0 top
C11  32.31,58.55 90 top
C12  34.57,62.31 270 top
C13  37.03,16.44 90 top
C14  16.46,106.68 0 top
C15  10.08,97.08 0 top
C17  10.08,98.55 0 top
C18  9.8,105.26 90 top
C19  9.8,102.24 270 top
C20  16.59,91.36 180 top
C21  15.85,89.01 90 top
C22  37.97,24.73 90 top
C23  35.42,13.26 90 top
C24  34.09,25.66 180 top
C25  16.69,98.38 180 top
C26  51.26,97.13 90 top
C27  52.88,97.13 90 top
C28  54.48,97.13 90 top
C29  33.86,13.28 90 top
C30  36.45,24.73 270 top
C31  13.54,91.35 180 top
C32  13.51,92.94 180 top
C33  60.15,99.01 90 top
C34  60.15,102.01 270 top
C35  46.48,91.16 270 top
C36  46.08,87 270 top
C37  47.65,87 90 top
C38  55.83,81.61 90 top
C39  57.38,81.61 90 top
C40  54.46,87.12 270 top
C41  48.01,91.16 90 top
C42  48.79,94.57 180 top
C45  52.22,94.57 0 top
C54  55,23.98 90 top
CHRG  46.2,83.16 180 top
D1  34.52,59.01 90 top
D2  46.35,64.77 180 top
D3  44.4,87.43 90 top
D4  59.7,16.64 180 top
D5  15.93,95.61 90 top
D11  51.84,88.29 180 top
DONE  44.48,83.16 180 top
FB1  [0603']  13.89,66.96 90 top
FLASH  65.02,48.63 180 top
IC1  52.86,61.08 270 top
IC2  53.72,100.99 270 top
J1  40.56,101.77 0 top
J2  25.54,101.79 0 top
L1  38.53,60.86 270 top
LED1  46.53,56.87 270 top
P2  23,31.8 90 top
P5  21.2,81.55 90 top
PWR  60.67,24.74 270 top
Q1  7.75,103.76 90 top
Q2  47.32,52.84 90 top
Q3  57.37,51.24 270 top
Q4  57.38,54.64 270 top
Q5  13.28,95.56 90 top
Q6  54.03,90.76 180 top
Q7  43.08,52.45 0 top
R2  13.51,98.38 0 top
R3  14.27,89 90 top
R4  49.38,23.98 90 top
R5  47.24,23.98 90 top
R6  45.06,23.98 90 top
R7  52.5,23.98 90 top
R8  50.95,23.98 90 top
R9  43.36,23.98 90 top
R10  49.83,64.87 0 top
R11  48.31,62.99 180 top
R12  56.44,67.82 0 top
R13  56.54,64.32 0 top
R14  56.59,79.25 0 top
R15  56.57,74.68 0 top
R16  9.58,41.2 180 top
R17  16.56,92.94 0 top
R18  46,60.73 90 top
R19  60.96,22.96 0 top
R20  56.59,76.2 180 top
R21  56.59,77.73 180 top
R22  57.84,47.86 270 top
R23  36.14,55.86 90 top
R24  10.08,95.56 180 top
R25  54.79,52.93 90 top
R26  57.15,57.19 0 top
R27  34.98,18.85 0 top
R28  49.53,78.21 180 top
R29  57.34,60.06 90 top
R30  50,49.68 90 top
R31  39.75,52.96 0 top
R32  34.62,52.66 90 top
R33  36.17,52.66 90 top
R34  16.94,34.75 0 top
R35  16.94,33.18 0 top
R36  18.47,28.45 0 top
R37  16.94,30.13 180 top
R38  16.94,31.65 0 top
R39  43.08,55.98 90 top
R41  57.86,99.77 0 top
R42  33.84,16.44 270 top
R43  57.89,101.25 0 top
R44  35.44,16.44 270 top
R45  49.99,52.84 270 top
R46  49.56,97.13 270 top
R47  32.28,16.45 270 top
R48  44.4,91.16 270 top
R49  30.71,16.42 90 top
R50  48.31,49.68 270 top
R51  49.5,104.07 0 top
R52  34.52,23.22 90 top
R53  49.5,105.59 0 top
R54  53.98,105.64 270 top
R55  49.5,99.52 180 top
R56  49.5,101.02 180 top
R57  49.5,102.49 0 top
R58  56.54,73.18 180 top
R59  39.75,49.89 180 top
R60  39.75,51.44 0 top
R61  46.23,79.5 270 top
R62  44.48,79.56 270 top
R63  36.45,21.64 90 top
RST  64.92,55.1 180 top
SD  47.24,21.06 270 top
SPK  62.2,100.51 90 top
U1  12.8,52.55 90 top
U2  39.22,55.68 0 top
U3  14.48,102.59 0 top
U5  50.5,91.65 0 top
U6  50.93,83.14 90 top
U8  31.79,21.86 180 top
U$1  [MAKERFABS_0.3]  7.94,67.52 90 top
USB-NATIVE  60.7,77.14 90 top
USB-TTL  60.68,66.11 90 top

### Tracks (layer width: path | path; a pad name or v marks a point on that pad's centre or on a via)
3.3V  (via drill 0.3)  (3 unrouted)
  Top 0.254: 32.79,25.89 32.84,25.94 | R52.2 | U8.1 32.79,25.99 | P5.4 v19.34,89.8 | v19.34,89.8 v19.33,89.79 15.87,89.79 C21.2 | 19.56,89.56 19.79,89.79 19.56,90.02 19.38,90.02 19.34,89.98 v19.34,89.8 | P2.6 19.83,33.05 v19.33,33.55 | C21.2 R3.2 14.3,89.79 C31.1 14.28,91.37 C32.1 | Q5.1 C32.1 | C32.1 | D5.+ 15.93,93.07 R17.1 15.8,91.39 | 15.8,91.39 C20.2 | 15.8,91.39 15.8,89.82 C21.2 | v37.49,23.05 37.49,23.55 37.22,23.82
  Top 0.61: C24.2 33.12,25.66 v31.83,26.95 | C30.2 R52.2 | R52.2 | R52.2 32.99,23.97 32.99,25.61 33.07,25.68 33.15,25.68 33.45,25.38 33.45,24.54 33.81,24.18 36.65,24.18 | R36.2 19.33,28.55 v19.33,29.31
  Top 0.813: R47.2 R42.2 | R42.2 33.84,14.07 C29.2 33.89,14.02 C23.2 v36.55,14.02 | R44.2 R42.2 | 35.43,15.6 35.43,15.14 v36.55,14.02 | v36.55,14.02 35.74,14.02 34.54,15.22 34.54,14.3 | R63.2 C30.2 36.56,24.08 37.85,24.08 C22.1 37.97,23.74 36.58,22.36 36.58,23.17 37.22,23.82 37.34,23.93
  Bottom 0.61: v19.33,89.79 v19.33,33.55 v19.33,29.31 19.33,27.94 20.32,26.95 v31.83,26.95
  Bottom 0.813: v36.55,14.02 37.49,14.96 v37.49,23.05
  pour Top: 13.82,95 13.82,89.56 14.07,89.31 19.3,89.31 19.74,89.74 19.74,89.87 19.33,90.27 16.51,90.27 16.31,90.48 16.31,94.92 16.23,95
5V  (via drill 0.3)  (2 unrouted)
  Top 0.254: C36.2 C37.1 U6.8 49,86.24 | C36.2 D3.+ | C36.2 46.2,86.11 CHRG.A DONE.A | v59.38,79.61 59.38,79.59 | 54.97,91.77 Q6.1
  Top 0.61: USB-NATIVE.VBUS1 59.37,74.69 57.91,73.23 57.35,73.23 R58.1 | USB-NATIVE.VBUS2 59.15,79.59 57.89,80.85 C39.1 C38.1 v53.65,80.85 U6.4
  Top 0.813: R18.2 46,64.98 | 46,64.98 v46,70.06 | D2.- 45.8,64.77 46,64.98
  Top 1.016: Q6.1 54.98,92.27 v54.74,92.51
  Bottom 0.813: v46,70.06 54.74,70.06 v59.38,74.7 v59.38,79.61 | 54.76,87.73 54.76,87.43 53.52,86.19 54.79,84.92
  Bottom 1.016: v53.65,80.85 54.74,81.94 54.74,86.24 | 54.74,86.24 v54.74,92.51 | v48.44,86.24 54.74,86.24
  pour Top: 43.74,83.52 47.14,83.52 49.28,85.65 49.28,86.77 43.79,86.77 43.74,86.77
  pour Top: 52.55,79.3 53.14,79.3 54.03,80.19 58.14,80.19 58.98,79.35 61.52,79.35 61.52,79.86 60.02,79.86 58.5,81.38 53.19,81.38 52.55,80.75
!SD
  Top 0.254: IC2.P$4 50.99,100.24 R55.1
+3V3  (via drill 0.3)  (1 unrouted)
  Top 0.254: IC1.5 IC1.6 51.46,63.08 50.6,63.94 R10.2 C5.2 C3.2 | R46.2 C42.1 U5.5 | 41.6,101.63 J1.3
  Top 0.406: v58.28,15.74 v58.27,15.73
  Top 0.61: SD.4 48.34,24.66 48.26,24.74 | D4.4 v58.28,15.74 | 47.75,24.67 48.34,24.08 49.05,24.79 49.45,24.79 | R63.1 36.91,20.88 36.96,20.83
  Top 0.813: U1.2 R16.2 C10.1 C9.1 8.79,35.94 8.79,24.36 arc90 13.29,19.86 v20.24,19.86 | J2.3 26.54,99.75 27.15,99.14 v41.05,99.14 41.6,99.7 41.6,101.63
  Top 1.016: v59.61,25.99 PWR.A C54.2 R7.2 R8.2 R4.2 48.26,24.74 R5.2 R6.2 R9.2 40.88,24.74 36.96,20.83 v35.99,19.86 35.74,19.6 R27.2 | v51.38,63.91 50.6,64.7 R10.2 | R22.2 v59.61,47.1 | C3.2 50.6,75.39 v53.09,77.91
  Bottom 0.305: 59.61,30.43
  Bottom 0.813: v20.24,19.86 v35.99,19.86
  Bottom 1.016: v58.27,15.73 59.61,17.07 v59.61,25.99 59.61,30.43 v59.61,47.1 59.61,59.49 55.19,63.91 v51.38,63.91 | v53.09,77.91 56.11,80.9 56.11,93.75 54.41,95.46 v49.55,95.46 44.73,95.46 v41.05,99.14
  pour Top: 49.15,92.36 49.15,96.78 50.04,96.78 50.04,92.36
D+
  Top 0.254: USB-TTL.B6 61.78,66.86 62,67.08 62.71,67.08 63.02,66.78 63.02,66.12 62.76,65.87 USB-TTL.A6 54.02,65.86 53.11,64.95 IC1.3
D-  (via drill 0.3)
  Top 0.254: USB-TTL.B7 62.27,65.36 v62.38,65.26 | v62.38,66.48 62.28,66.37 61.03,66.37 USB-TTL.A7 53.63,66.36 52.61,65.34 IC1.4
  Bottom 0.254: v62.38,65.26 v62.38,66.48
DCLK
  Top 0.254: P5.30 17.62,76.8 17.14,77.27 15.06,77.27 14.53,77.27 14.43,77.27 13.89,76.74 C1.2 FB1.2
DTR  (via drill 0.3)
  Top 0.254: IC1.23 58.02,61.83 58.42,61.42 58.42,58.63 v57.94,58.14 57.94,57.21 R26.2 | Q3.2 55.43,50.29 v55.42,50.3
  Bottom 0.254: v55.42,50.3 55.42,55.63 v57.94,58.14
GAIN
  Top 0.254: IC2.P$2 50.49,101.24 R56.1 R57.2
GND  (via drill 0.3)  (2 unrouted)
  Top 0.254: IC1.2 53.61,61.8 v53.54,61.73 | P5.3 26.8,90.3 v29.08,88.01 | P5.14 23.61,84.8 v23.67,84.86 | P5.29 v23.59,77.3 v23.6,77.3 | P5.36 v23.36,73.8 v23.37,73.79 | 20.62,89.28 21.74,89.28 21.74,88.29 20.62,88.29 20.62,89.03 21.69,89.03 21.69,88.55 20.5,88.55 | 20.55,85.22 21.79,85.22 21.79,84.99 20.5,84.99 | 20.47,81.03 21.79,81.03 21.79,80.55 20.4,80.55 | USB-NATIVE.GND2 60.68,80.37 59.44,81.61 v59.44,82.55 | IC2.P$3 53.62,100.74 v53.7,100.66 | IC2.P$15 53.47,101.43 v53.34,101.3 | IC2.P$11 55.85,101.24 55.85,101.25 | 56.11,101.5 55.85,101.25 | 55.85,101.25 53.85,101.25 53.7,101.1
  other vias: 62.23,59.64 51.89,62 52.73,62 53.8,61.06 53.64,60.38 52.55,61.29 51.97,61.45 51.99,60.84 52.04,60.18 52.63,60.68 53.04,60.15 53.14,61.04 62.89,55.1 63.37,58.63 14.43,58.35 56.79,36.71 63.7,13.31 49.99,11.94 54.15,11.48 48.95,9.86 47.68,11.48 51.23,9.38 65.89,5.92 14.43,59.54 64.06,16.69 62.33,4.83 63.78,60.23 62.99,57.08 62.74,52.02 62.79,49.05 65.35,52.1 44.27,67.87 64.59,68.41 64.62,65.33 64.49,63.5 52.78,68.18 53.21,72.82 47.83,72.52 40.31,82.2 40.23,85.75 38.79,95.86 62.28,86.97 41.05,93.91 29.97,93.65 55.02,108.59 58.78,108.99 31.39,95.86 40.46,78.72 10.39,109.15 34.9,97.51 29.39,96.95 18.54,94.26 64.64,78.62 64.49,76.03 64.14,73.74 63.65,83.11 23.16,98.1 61.52,106.94 18.8,92.08 39.78,105.79 25.63,97.59 27.94,96.83 64.49,99.67 55.93,110.01 27.79,105.41 30.35,105.79 42.34,105.77 20.57,105.77 38,105.44 62.61,111.53 65.1,111.66 13.59,105.87 1.63,110.21 1.22,101.4 3.86,109.05 27.23,108.51 5.05,112.47 1.07,112.37 2.06,107.88 59.61,94.67 64.64,94.82 2.49,104.22 5.89,107.65 6.93,99.85 3.84,91.82 3.56,86.59 18.67,96.19 3.84,80.27 26.47,92.99 65.35,88.09 54.05,101.3 62.08,109.63 61.34,90.53 62.48,94.44 3.48,110.9 45.24,106.81 36.65,96.73 64.19,106.61 65.86,109.4 32.08,92.94 29.49,83.82 40.16,71.17 23.85,83.72 24.26,81.66 28.24,93.32 22.3,96.32 16.81,87.02 17.65,79.38 23.65,66.98 44.04,37.11 42.65,39.42 48.29,28.32 30.2,29.49 52.55,36.02 48.26,39.3 56.64,38.56 64.92,22 32.26,9.1 54.51,39.45 63.6,40.39 63.35,44.81 63.02,31.24 53.92,31.7 52.53,16.16 48.34,32.01 61.95,29.9 57.89,30.89 39.47,38.81 45.09,39.32 62.31,38.97 59.54,9.45 2.9,11.99 11.81,10.37 32.56,36.63 47.7,68.15 2.82,7.75 6.1,7.98 11.43,14.86 3.89,15.17 14.66,27.54 13.72,30.03 9.45,17.81 36.42,36.05 48.74,15.24 8.2,51.06 9.07,47.3 8.51,53.19 14.4,48.57 8.03,48.19 7.59,40.54 8,45.98 8.23,49.76 7.16,15.47 2.21,22.35 6.78,10.8 32.72,30.86 14.35,52.1 9.6,12.75 8.94,58.93 8.51,69.55 8.03,57.91 14.35,51.26 8.33,73.13 2.21,76.25 8.43,71.12 7.87,63.6 8.81,84.15 39.7,41.46 48.31,34.7 52.07,32.74 44.68,41.18 52.07,11.86 22.78,29.34 47.93,16.03 36.47,30.97 23.75,40.62 22.12,39.88 8.31,55.93 44.15,14.13 48.29,41.38 25.1,9.12 56.24,34.45 64.52,37.21 63.78,52.76 65.18,45.75 65.79,57.48 65.86,59.62 37.47,9.3 63.78,43.61 41.5,96.47 23.39,68.48 12.47,89.46 22.56,57.56 24.1,64.29 9.96,56.57 48.36,37.06 40.28,74.37 26.42,96.04 55.91,96.6 5.23,110.32 3.78,104.9 61.19,96.42 64.03,10.72 39.01,34.72 34.47,37.32 34.57,33.99 34.52,40.59 34.54,28.45 30.07,31.14 30.81,34.57 54.25,16.34 27.15,38.23 23.7,50.63 23.75,46.94 13,34.12 14.38,24.01 18.39,11.61 6.68,25.05 3.66,28.83 2.59,26.55 5.26,25.68 1.57,5.67 63.35,6.07 29.18,10.52 52.55,45.47 61.82,42.78 61.52,33.91 47.45,16.64 27.84,31.47 43.92,35.41 24,65.48 54.15,9.53 63.2,19.18 64.92,67.49 59.21,62.26 8.59,108.77 16.97,80.27 8.81,80.37 18.19,80.5 17.58,86.13 12.75,87.58 3.86,96.29 8.71,88.6 4.06,77.47 45.72,99.7 58.29,104.78 24.28,95.05 14.43,50.17 14.94,41.25 8.61,54.46 12.78,35.89 7.65,33.43 7.52,37.7 7.19,28.22 14.05,21.49 24.56,31.04 22.02,46.99 23.8,48.8 41.73,22.84 25.02,39.09 28.4,21.59 61.44,88.73 1.35,96.45 34.09,96.19 5.23,83.34 8.38,67.06 5.49,22.33 2.08,19.26 22.58,59.39 22.81,64.11 33.88,56.26 33.4,52.2 37.62,53.42 44.07,62.44 37.44,41.89 42.16,41.66 36.5,66.5 33.81,103.15 34.9,65.48 33.22,63.91 34.26,101.2 31.75,102.03 35.64,104.17 59.28,71.22 53.9,74.68 42.06,108.71 15.72,110.21 13.11,110.11 25.35,108.66 21.87,109.17 23.75,109.1 17.53,109.43 50.57,91.52 33.38,108.69 39.22,109.78 65.43,100.82 53.09,93.42 46.1,101.65 64.62,89.16 5.84,93.73 61.87,84.94 56.11,97.95 6.83,98.68 17.25,88.29 24.23,89.54 28.07,89.26 32.69,83.37 32.77,89.26 32.77,77.14 32.61,70.69 33.6,66.3 37.82,108.74 32.18,104.37 33.86,106.56 49.73,55.5 50.19,57.71 52.93,52.58 53.59,55.02 54.2,49.3 54,50.98 52.73,49.89 45.75,49.76 50.09,56.75 39.9,65.08 44.5,56.8 37.85,51.84 29.79,42.85 30.66,40.03 27.2,40.44 25.25,37.16 28.88,35.56 40.82,17.27 65.25,20.25 53.04,29.16 45.06,28.7 41.68,35.26 43.46,27.69 43.51,31.5 40.39,31.75 14.4,39.12 13.06,32.49 1.73,30.89 6.2,30.76 7.92,65.26 7.8,76.2 24.18,75.59 32.74,73.87 32.82,80.29 32.79,86.69 29.54,86.46 29.62,81.64 25.12,105.72 22.53,105.34 65.86,77.47 46.51,93.5 42.27,90.91 46.96,88.75 60.02,83.39 18.69,21.69 21.64,21.67 24.89,21.69 27.51,21.47 29.77,21.59 29.82,18.54 28.73,15.45 31.06,13.39 28.02,13.13 39.12,13.03 40.41,19.31 41.12,14.89 41.43,8.61 49.73,45.85 55.45,43.56 39.14,55.65 39.22,54.59 22.02,49.71 22.05,51.84 22.07,36.99 49.58,84.28 50.88,84.38 52.02,84.38 52.45,83.62 52.15,82.76 51.16,83.34 50.22,83.52 49.66,82.71 50.14,82.07 51.13,82.5 51.66,82.02 51.64,78.51 47.65,79.38 45.42,75.75
  pour Top (isolate 0.254, rank 6): -7,126.05 -7,-13.95 150,-13.95 150,126.05
  pour Bottom (isolate 0.254, rank 6): -6,-13.95 150,-13.95 150,126.05 -6,126.05
I2S_BCLK
  Top 0.254: IC2.P$16 52.97,102.89 R53.2
I2S_DIN
  Top 0.254: IC2.P$1 52.32,102.01 R51.2
I2S_LRCLK
  Top 0.254: IC2.P$14 R54.2
IO0  (via drill 0.3)  (1 unrouted)
  Top 0.254: FLASH.2 58.34,48.63 | 58.34,48.63 R22.1 56.32,48.63 54.86,47.17 33.43,47.17 v28.17,52.43 | U1.27 24,61.25 v24,52.43 | Q3.3 58.38,48.67 58.34,48.63 | 58.4,49.08 58.4,48.92 58.67,48.64
  Bottom 0.254: v24,52.43 v28.17,52.43
IO1  (via drill 0.3)
  Top 0.254: P5.28 v9.43,77.8 | U1.39 8.81,62.45 v9.43,63.07
  Bottom 0.254: v9.43,63.07 v9.43,77.8
IO2  (via drill 0.3)
  Top 0.254: U1.38 10.08,62.59 v10.06,62.61 | R54.1 v53.98,107.62
  Bottom 0.254: v10.06,62.61 10.06,104.32 13.36,107.62 v53.98,107.62
IO3  (via drill 0.3)
  Top 0.254: U1.15 26.68,45.56 v26.7,45.55 | P5.25 v30.07,79.3
  Bottom 0.254: v30.07,79.3 30.07,48.92 v26.7,45.55
IO4  (via drill 0.3)
  Top 0.254: P5.20 v11.89,81.8 | U1.4 11.38,43.83 11.38,44.94 v11.89,45.44
  Bottom 0.254: v11.89,81.8 11.89,45.83 11.89,45.82 v11.89,45.44
IO5  (via drill 0.3)
  Top 0.254: P5.15 17.56,84.3 16.82,85.04 v12.78,85.04 | v12.5,45.03 12.5,43.92 U1.5
  Bottom 0.254: v12.78,85.04 12.5,84.76 v12.5,45.03
IO6  (via drill 0.3)
  Top 0.254: v13.18,84.41 16.64,84.41 17.25,83.8 P5.16 | U1.6 13.89,44.79 v13.13,45.55
  Bottom 0.254: v13.18,84.41 13.01,84.23 13.01,45.68 v13.13,45.55
IO7  (via drill 0.3)
  Top 0.254: P5.17 16.91,83.3 16.41,83.8 v13.64,83.8 | U1.7 15.16,44.74 v13.63,46.28
  Bottom 0.254: v13.64,83.8 13.51,83.67 13.51,46.39 v13.63,46.28
IO8  (via drill 0.3)
  Top 0.254: P5.24 22.42,79.8 v22.55,79.94 | U1.12 21.51,42.7 v21.36,42.55
  Bottom 0.254: v21.36,42.55 21.36,78.74 v22.55,79.94
IO9  (via drill 0.3)
  Top 0.254: U1.17 v26.64,48.1 v26.64,48.11 | P5.27 28.6,78.3 v28.85,78.05
  Bottom 0.254: v28.85,78.05 28.85,50.32 v26.64,48.11
IO10/CS  (via drill 0.3)
  Top 0.406: U1.18 26.58,49.37 32.15,43.8 v50.55,43.8 | D4.1 60.45,18.11 60.12,18.44 51.77,18.44 50.54,19.67 SD.2 v50.54,22.15 v50.55,22.15 50.55,22.81 R8.1
  Bottom 0.406: v50.55,43.8 v50.55,22.15
IO11/MOSI  (via drill 0.3)
  Top 0.254: 49.43,21.04 SD.3
  Top 0.406: U1.19 26.52,50.64 32.62,44.55 v49.44,44.55 | D4.3 51.02,17.54 49.45,19.1 49.45,21.05 SD.3 v49.44,22.25 49.44,23.15 R4.1
  Bottom 0.406: v49.44,44.55 v49.44,22.25
IO12/SCLK  (via drill 0.3)
  Top 0.406: U1.20 26.41,51.91 33.08,45.25 v47.24,45.25 | D4.5 59.7,15.2 59.31,14.81 50.88,14.81 47.24,18.44 SD.5 v47.24,22.23 R5.1
  Bottom 0.406: v47.24,45.25 v47.24,22.23
IO13/MISO  (via drill 0.3)
  Top 0.254: SD.7
  Top 0.406: U1.21 26.25,53.18 33.38,46.05 v46.3,46.05 | D4.6 60.45,14.7 59.74,14 47.85,14 v46.3,15.55 45.06,16.79 45.06,21.04 SD.7 45.06,21.08 R6.1
  Bottom 0.406: v46.3,46.05 v46.3,15.55
IO14  (via drill 0.3)
  Top 0.254: U1.22 25.9,54.45 28.25,56.8 v28.25,59.97 | P5.12 v28.25,85.8
  Bottom 0.254: v28.25,59.97 v28.25,85.8
IO15  (via drill 0.3)
  Top 0.254: P5.18 16.62,82.8 16.26,83.16 v15.34,83.16 | U1.8 16.43,44.83 v15.67,45.59
  Bottom 0.254: v15.34,83.16 15.24,83.06 15.24,47.07 14.99,46.82 14.99,46.28 v15.67,45.59
IO16  (via drill 0.3)
  Top 0.254: P5.19 15.98,82.3 v15.85,82.43 | U1.9 17.7,44.59 v15.75,46.55
  Bottom 0.254: v15.75,46.55 15.75,82.32 v15.85,82.43
IO17/I2C_SDA  (via drill 0.3)
  Top 0.254: v33.33,21.49 32.74,21.49 32.29,21.04 U8.9 32.29,17.22 R47.1 | v20.62,41.75 19.16,41.75 18.97,41.94 U1.10 | P2.2 20.86,31.05 v20.62,30.81 | U3.5 19.94,100.69 v21.13,99.5 21.79,99.5 24.03,99.5 24.54,100 J2.2
  Bottom 0.254: 20.73,41.74 20.73,99.09 v21.13,99.5 | 20.73,41.74 20.73,30.79 | v20.62,41.75 20.71,41.75 20.73,41.74 | v20.62,30.81 20.7,30.81 20.73,30.79 | 20.73,30.79 20.73,28.91 21.34,28.3 32.56,28.3 33.33,27.54 v33.33,21.49
IO18/I2C_SCL  (via drill 0.3)
  Top 0.254: 32.79,20.55 U8.10 32.79,20.73 32.92,20.86 | 32.92,20.86 33.3,20.86 33.38,20.78 33.38,19.36 33.15,19.13 | v20.12,42.55 20.12,44.22 20.02,44.33 20.02,44.02 U1.11 | P2.3 20.27,31.55 v20.12,31.4 | 33.07,20.73 v33.05,20.76 33.02,20.76 32.92,20.86 | U3.6 v20.02,101.96 21.23,101.96 22.27,101.96 J2.1
  Top 0.406: 33.07,20.73 33.07,19.64 33.6,19.1 34.44,19.1
  Top 0.813: R42.1 33.84,18.48 R27.1 33.43,18.85 | 33.43,18.85 33.15,19.13 33.07,19.21 | 33.43,18.85 33.83,18.44 33.83,17.28
  Bottom 0.254: v20.02,101.96 20.02,42.55 | 20.02,42.55 20.02,31.4 | v20.12,42.55 20.02,42.55 | 20.02,42.55 | v20.12,31.4 20.02,31.4 | 20.02,31.4 20.02,28.63 20.93,27.71 32.13,27.71 32.66,27.18 32.66,21.14 v33.05,20.76
IO19  (via drill 0.3)
  Top 0.254: U1.13 22.78,42.78 23.09,42.47 v26.57,42.47 | J1.1 37.56,103.53 38.1,104.07 v47.85,104.07 R51.1 | R20.2 v54.86,76.2
  Bottom 0.254: v26.57,42.47 31.93,47.83 31.93,58.96 49.17,76.2 v54.86,76.2 57.84,79.18 57.84,101.55 55.32,104.07 v47.85,104.07
IO20  (via drill 0.3)
  Top 0.254: U1.14 26.44,43.8 v26.47,43.77 | J1.2 v39.56,103.32 v39.57,103.33 | R53.1 v46.91,105.59 | R21.2 v54.99,77.73
  Bottom 0.254: v26.47,43.77 31.32,48.62 31.32,59.34 48.82,76.84 54.1,76.84 v54.99,77.73 57.17,79.91 57.17,100.92 54.76,103.33 47.3,103.33 | v39.57,103.33 46.41,103.33 46.51,103.33 | 46.51,103.33 46.89,103.33 | v46.91,105.59 46.91,103.74 | 46.91,103.74 46.91,103.71 | 46.91,103.71 46.91,103.36 46.89,103.33 | 46.91,103.71 47.3,103.33 | 47.3,103.33 46.89,103.33 | 46.51,103.33 46.91,103.74
IO21  (via drill 0.3)
  Top 0.254: U1.23 25.8,55.72 27.64,57.56 v27.64,60.51 | P5.11 27.52,86.3 v27.64,86.41
  Bottom 0.254: v27.64,60.51 v27.64,86.41
IO38  (via drill 0.3)  (1 unrouted)
  Top 0.254: U8.7 31.29,22.81 v31.27,22.84 | v16.36,59.85 18.55,59.85 18.97,60.28 U1.31 | R38.1 16.18,32.36 | 16.18,32.36 R35.1 | v16.26,32.4 16.22,32.4 16.18,32.36
  Bottom 0.254: v16.36,59.85 16.36,32.3 | v31.27,22.84 19.23,22.84 16.36,25.71 16.36,32.3 | 16.36,32.3 v16.26,32.4
IO39  (via drill 0.3)
  Top 0.254: P5.32 16.59,75.8 v16.48,75.9 | U1.32 17.7,61.7 v16.36,63.05
  Bottom 0.254: v16.36,63.05 16.36,75.77 v16.48,75.9
IO40  (via drill 0.3)
  Top 0.254: P5.34 14.68,74.8 v14.63,74.75 | U1.33 16.43,62.01 14.89,63.55 v14.63,63.55
  Bottom 0.254: v14.63,74.75 v14.63,63.55
IO41  (via drill 0.3)
  Top 0.254: P5.33 14.8,75.3 v14.63,75.47 | U1.34 15.16,62.22 v14.63,62.75
  Bottom 0.254: v14.63,75.47 14.58,75.47 arc90 14.02,74.91 14.02,63.17 arc90 14.45,62.75 v14.63,62.75
IO42
  Top 0.254: U1.35 FB1.1
IO45  (via drill 0.3)
  Top 0.254: U1.26 25.52,59.53 25.81,59.82 v25.81,60.94 | P5.8 25.69,87.8 v25.81,87.91
  Bottom 0.254: v25.81,60.94 v25.81,87.91
IO46  (via drill 0.3)
  Top 0.254: U1.16 v26.64,46.83 v26.64,46.84 | P5.26 29.31,78.8 v29.46,78.65
  Bottom 0.254: v29.46,78.65 29.46,49.66 v26.64,46.84
IO47  (via drill 0.3)
  Top 0.254: U1.24 25.82,56.99 27.03,58.19 v27.03,59.97 | P5.10 26.9,86.8 v27.03,86.92
  Bottom 0.254: v27.03,59.97 v27.03,86.92
IO48  (via drill 0.3)
  Top 0.254: U1.25 26.08,58.26 26.42,58.6 v26.42,60.51 | P5.9 26.28,87.3 v26.42,87.43
  Bottom 0.254: v26.42,60.51 v26.42,87.43
LED+  (via drill 0.3)
  Top 0.254: v31.52,90.8 P5.2 | 34.57,60.26 D1.-
  Top 0.406: 34.54,60.23 D1.-
  Top 0.61: U2.5 v41.45,55.68 | v31.52,61.29 31.52,60.99 C11.2 D1.- | 34.54,60.23 v35.23,60.23
  Top 0.813: C12.2 34.57,60.26
  Bottom 0.61: v31.52,61.29 v31.52,90.8 | v35.23,60.23 36.91,60.23 v41.45,55.68
LED-  (via drill 0.3)
  Top 0.254: P5.1 30.54,91.3 v30.68,91.44
  Top 0.61: U2.3 37.48,54.73 R33.2 R32.2 32.01,53.42 v30.68,54.75
  Bottom 0.254: v30.68,54.75 v30.68,91.44
N$1
  Top 0.254: IC1.16 C4.2
N$2
  Top 0.254: Q4.1 56.37,57.17 R26.1
N$3
  Top 0.254: R25.1 56.34,52.17 Q3.1
N$4
  Top 0.406: U3.1 C18.1 8.21,104.5 Q1.P$1
N$5
  Top 0.254: R50.1 48.31,51.87 Q2.1 48.53,52.08 R45.2
N$6
  Top 0.254: USB-NATIVE.A5 58.54,75.89 R15.2
N$7
  Top 0.61: PWR.C R19.2
N$8
  Top 0.254: R18.1 46,58.9 LED1.1
N$9
  Top 0.254: Q2.3 46.3,55.13 LED1.2
N$10
  Top 0.254: USB-TTL.A5 57.85,64.86 R13.2
N$11
  Top 0.254: USB-TTL.B5 57.24,67.86 R12.2
N$12
  Top 0.254: IC1.7 49.74,62.33 R11.1
  Top 0.813: R10.1 R11.1
N$13
  Top 0.406: U3.2 10.03,103.23 C19.1 8.19,103 Q1.P$2
N$14
  Top 0.254: USB-NATIVE.B5 57.71,78.89 R14.2
N$15
  Top 0.61: Q5.3 R24.1
N$16
  Top 0.61: C15.2 C17.2 11.02,98.38 R2.1
N$17
  Top 0.254: U2.1 36.65,56.63 | 36.65,56.63 36.15,56.63 R23.2 | L1.P$2 36.68,57.76 | 36.68,57.76 36.68,56.66 36.65,56.63 | D1.+ 36.64,57.81 36.68,57.76
  pour Top: 38.56,56.34 35.1,56.34 34.11,57.33 34.11,58.25 34.34,58.47 35.51,58.47 35.86,58.83 35.86,62.92 37.39,62.92 37.39,58.37 38.53,57.23 38.56,57.2
N$18
  Top 0.254: IC1.21 R29.2
N$19  (via drill 0.3)
  Top 0.254: IC1.20 55.6,60.33 55.91,60.02 v55.91,58.86 | R30.2 v50.95,50.45
  Bottom 0.254: v55.91,58.86 50.95,53.9 v50.95,50.45
N$20  (via drill 0.3)
  Top 0.813: v10.97,17.05 BT1.2 | R24.2 9.32,92.7 v10.97,91.05
  Bottom 0.813: v10.97,91.05 v10.97,17.05
N$21
  Top 0.254: IC2.P$9 56.63,100.24 R41.1
N$22
  Top 0.406: C2.2 R23.1
N$23
  Top 0.254: IC2.P$10 56.62,100.74 R43.1
N$24
  Top 0.254: R31.2 40.51,53.5 | 40.51,53.5 U2.4 | 40.51,53.5 40.54,53.47 Q7.3 R39.1
N$25
  Top 0.254: R52.1 32.92,22.46 31.79,21.33 U8.8 31.79,18.26 R49.2
N$26
  Top 0.254: R41.2 C33.2 62.09,99.77 SPK.1
N$27
  Top 0.254: R43.2 C34.2 62.09,101.25 SPK.2
N$28  (via drill 0.3)
  Top 0.254: P5.31 17.23,76.3 16.98,76.55 v14.61,76.55 | v14.61,87.05 14.61,87.91 R3.1
  Bottom 0.254: v14.61,76.55 v14.61,87.05
N$29
  Top 0.254: R59.1 R60.2 Q7.1
N$30
  Top 0.254: U6.2 R28.1
N$31  (via drill 0.3)
  Top 0.406: U6.7 v50.29,87.3 | R61.2 v46.23,77.68
  Bottom 0.406: v46.23,77.68 46.23,85.96 47.57,87.3 v50.29,87.3
N$32  (via drill 0.3)
  Top 0.254: 51.54,86.26 U6.6
  Top 0.406: 51.54,86.26 v51.54,87.3 | R62.2 v44.48,77.63
  Bottom 0.406: v44.48,77.63 44.48,86.72 45.82,88.07 50.77,88.07 v51.54,87.3
N$33
  Top 0.406: CHRG.C 46.2,80.29 R61.1
N$34
  Top 0.406: DONE.C R62.1
N$47
  Top 0.406: SD.1 51.64,22.36 R7.1
N$48
  Top 0.406: SD.8 43.94,22.63 R9.1
N$76
  Top 0.254: U5.4 51.45,94.55 C45.1
RESET  (via drill 0.3)
  Top 0.254: v27.64,53.04 28.57,53.04 v33.6,48.01 | U1.3 10.08,52.2 11.61,53.72 22.31,53.72 23.1,52.94 v23.37,52.94 | RST.2 60.46,54.64 Q4.3 v57.56,54.64
  Top 0.406: U1.3 10.34,43.54 R16.1 C8.1 12.27,38.33 15.85,34.75 R34.1
  Bottom 0.254: v57.56,54.64 57.56,49.56 56.01,48.01 v33.6,48.01 | v27.64,53.04 23.47,53.04 v23.37,52.94
RST  (via drill 0.3)
  Top 0.254: v38.4,32.55 P2.5 18.33,32.55 R35.2 R34.2
  Top 0.406: R44.1 C13.2 v38.4,17.2
  Bottom 0.254: v38.4,17.2 v38.4,32.55
RTS
  Top 0.254: Q4.2 R25.2 54.86,53.77 IC1.19
RXD/IO44  (via drill 0.3)
  Top 0.254: U1.36 12.62,58.1 15.11,55.6 v23.11,55.6 | v28.14,55.6 28.7,55.6 33.66,50.65 v34.06,50.65 34.82,49.89 R59.2 | v56.52,59.52 57.13,59.52 R29.1
  Bottom 0.254: v23.11,55.6 v28.14,55.6 | v34.06,50.65 46.74,50.65 55.6,59.52 v56.52,59.52
TP_INT
  Top 0.254: P2.4 18.1,32.05 R38.2 R37.1 R36.1
TXD/IO43  (via drill 0.3)
  Top 0.254: U1.37 11.35,58.32 14.76,54.92 23.27,54.92 23.5,54.69 23.5,53.8 v23.37,53.67 | v27.13,53.67 28.93,53.67 33.68,48.92 R50.2 R30.1 | R30.1
  Bottom 0.254: v23.37,53.67 v27.13,53.67
USB_D+
  Top 0.254: USB-NATIVE.A6 62.03,76.89 62.26,77.12 62.26,77.6 61.98,77.88 61.06,77.88 USB-NATIVE.B6 57.52,77.89 R21.1
USB_D-
  Top 0.254: USB-NATIVE.B7 59.79,76.39 | USB-NATIVE.A7 60.17,77.39 59.82,77.04 59.82,76.74 | 59.82,76.74 59.82,76.42 59.79,76.39 | 59.82,76.74 59.49,76.41 60.15,76.41 59.82,76.74 | 59.79,76.39 57.54,76.39 R20.1
VBAT
  Top 0.254: BAT.+ 54.47,87.9 C40.1
  Top 0.406: U6.5 52.83,87.68 | 52.83,87.68 52.83,88.08 D11.+ | C40.1 53.85,87.89 | 53.85,87.89 53.03,87.89 52.83,87.68 | Q6.3 54.03,88.07 53.85,87.89
  pour Top: 59.92,87.33 53.98,87.33 53.52,86.87 53.52,85.65 52.45,85.65 52.45,89.11 53.47,90.12 54.33,90.12 56.03,88.42 59.92,88.42
VBUS  (via drill 0.3)
  Top 0.254: v59.11,63.66 | IC1.8 47.85,61.83 C6.2
  Top 0.61: USB-TTL.VBUS1 v59.11,63.66 | USB-TTL.VBUS2 v59.11,68.56 58.09,68.56 C7.2
  Top 1.016: v47.55,66.12 47.55,64.78 | 47.55,64.78 D2.+ | 47.55,64.78 R11.2 C6.2
  Bottom 0.254: 58.12,66.09 58.85,66.09 58.88,66.12
  Bottom 0.61: 59.16,65.05 58.12,66.09 59.05,67.03
  Bottom 0.813: v59.11,63.66 59.11,66.02 | 59.11,66.02 v59.11,68.56 | 58.88,66.12 59,66.12 59.11,66.02
  Bottom 1.016: 58.88,66.12 v47.55,66.12
VDD
  Top 0.254: IC2.P$7 IC2.P$8 C28.2 C27.2 C26.2 R46.1 48.74,98.71 | R56.2 R55.2 48.74,98.71 | R48.1 44.4,94.36 48.74,98.71
  pour Top: 43.81,91.52 43.81,94.62 47.93,98.73 47.93,101.55 49.3,101.55 49.3,98.94 49.71,98.53 53.62,98.53 53.85,98.76 53.85,99.95 54.89,99.95 54.89,97.41 48.18,97.41 44.93,94.16 44.93,91.54 44.93,91.52
VPWR
  Top 0.254: L1.P$1 40.52,60.73 U2.6 40.63,56.75 41.73,56.75 | U5.1 49.49,90.4 C41.1 C35.2 R48.2 D3.- 41.73,85.96 41.73,56.75 | Q6.2 52.86,91.76 U5.3 | R39.2 41.73,56.75
  Top 0.406: U5.1 49.55,89.39 D11.- 51.45,89.1 U5.3
  pour Top: 53.44,92.33 52.5,92.33 51.18,91.01 51.18,89.51 50.95,89.28 50.06,89.28 49.89,89.46 49.89,90.99 44.32,90.99 41.58,88.24 41.58,65.03 39.6,63.05 39.6,56.44 43.56,56.44 43.56,58.04 42.57,59.03 42.57,86.72 44.04,88.19 44.73,88.19 45.9,89.36 48.74,89.36 50.16,87.94 51.03,87.94 51.77,88.67 51.77,90.17 52.65,91.06 53.42,91.06 53.44,91.06
VRTC
  Top 0.254: Q5.2 15.62,96.51 D5.- C25.2 R2.2 14.28,103.97 14.81,104.5 U3.8 C14.2
  pour Top: 16.46,96.01 13.94,96.01 13.69,96.27 13.69,104.17 14.68,105.16 16.03,105.16 16.59,105.72 16.59,107.24 17.81,107.24 18.14,107.24 18.14,104.19 18.14,104.07 15.44,104.07 14.88,103.51 14.88,100.18 16.41,98.66 16.46,98.61
XN  (via drill 0.3)
  Top 0.254: v29.97,24.95 31.04,24.95 31.29,24.69 U8.4 | P5.39 v16.97,72.3
  Bottom 0.254: v16.97,72.3 17.39,72.3 arc-90 17.58,72.11 17.58,26.29 18.92,24.95 v29.97,24.95
XP  (via drill 0.3)
  Top 0.254: U8.2 32.29,25.34 31.47,26.17 v31.09,26.17 | P5.37 18.42,73.3 17.87,73.85 v16.97,73.85
  Bottom 0.254: v16.97,73.85 17.87,73.85 arc-90 18.59,73.13 18.59,27 19.43,26.17 v31.09,26.17
YN  (via drill 0.3)
  Top 0.254: 30.79,23.98 U8.5 v29.83,23.97 v29.82,23.98 | P5.40 17.74,71.8 17.5,71.56 v16.97,71.56 v16.97,71.55
  Bottom 0.254: v16.97,71.55 16.97,26.04 19.02,23.98 v29.82,23.98
YP  (via drill 0.3)
  Top 0.254: U8.3 31.79,24.98 31.22,25.56 v30.58,25.56 | P5.38 17.75,72.8 17.5,73.05 v16.97,73.05
  Bottom 0.254: v16.97,73.05 17.56,73.05 arc-90 18.09,72.52 18.09,26.65 19.18,25.56 v30.58,25.56

### Text on the board
tPlace: - | IO18/SCL | IO17/SDA | +3V3 | GND | IO19/D- | IO20/D+ | +3V3 | GND | + | - | + | ESP32-S3 Parallel TFT | with Touch 4.3" V2.0 | www.makerfabs.com | - | +